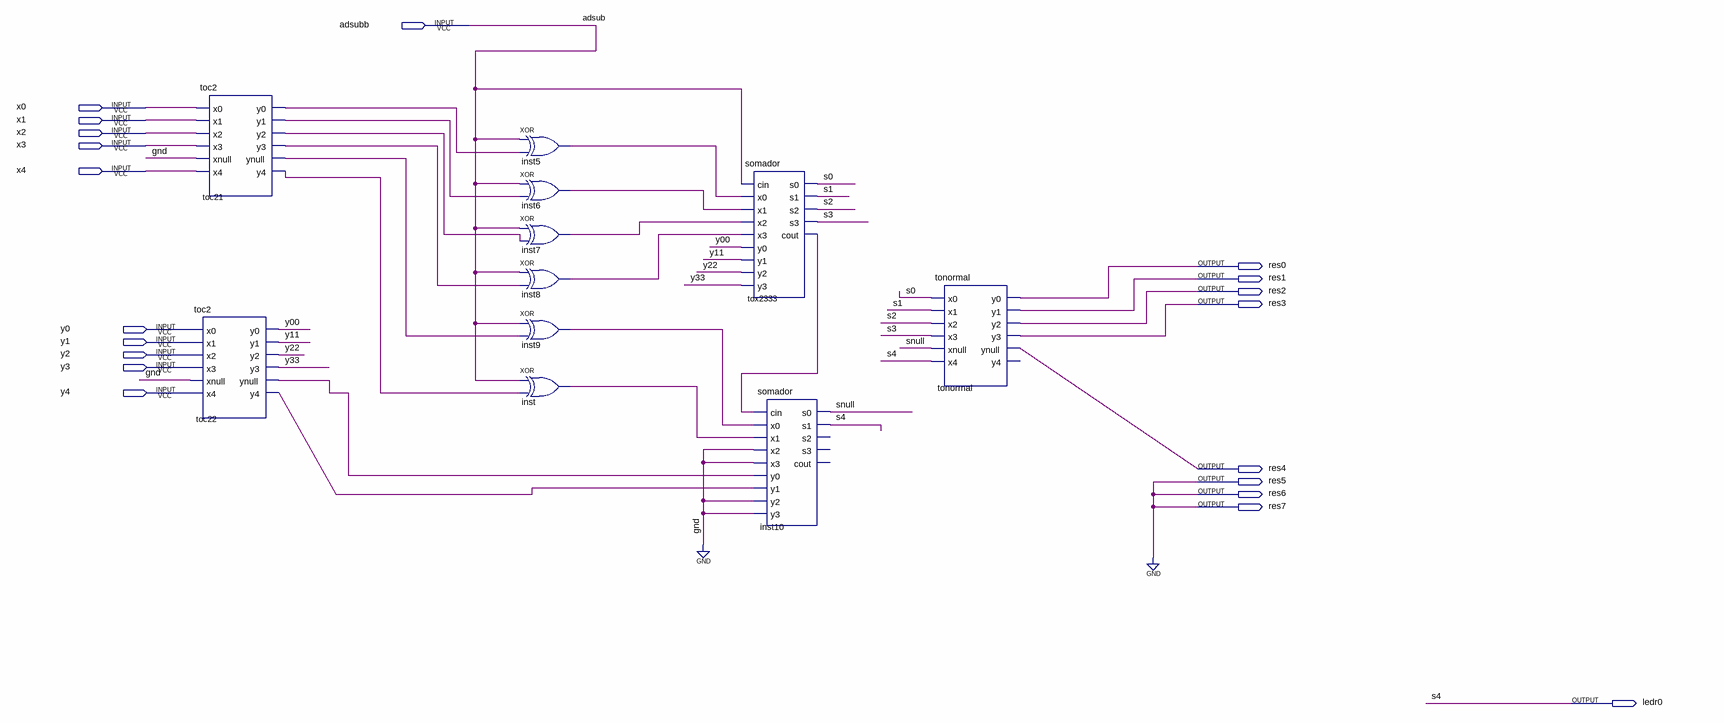
[diagram p0: schematic sheet]
// Quartus schematic subsum.bdf as structural Verilog: 11 symbols, 20 pins
module subsum (
  input  adsubb,
  input  x0,
  input  x1,
  input  x2,
  input  x3,
  input  x4,
  input  y0,
  input  y1,
  input  y2,
  input  y3,
  input  y4,
  output res0,
  output res1,
  output res2,
  output res3,
  output res4,
  output res5,
  output res6,
  output res7,
  output ledr0
);

  wire inst5_out, inst6_out, inst7_out, inst8_out, inst9_out, inst_out, s0, s1, s2, s3, snull, toc21_y0,
       toc21_y1, toc21_y2, toc21_y3, toc21_y4, toc21_ynull, toc22_y4, toc22_ynull, tox2333_cout, y00, y11,
       y22, y33;

  toc2 toc21 (
    .x0(x0), .x1(x1), .x2(x2), .x3(x3), .xnull(1'b0), .x4(x4), .y0(toc21_y0), .y1(toc21_y1), .y2(toc21_y2),
    .y3(toc21_y3), .ynull(toc21_ynull), .y4(toc21_y4));
  toc2 toc22 (
    .x0(y0), .x1(y1), .x2(y2), .x3(y3), .xnull(1'b0), .x4(y4), .y0(y00), .y1(y11), .y2(y22), .y3(y33),
    .ynull(toc22_ynull), .y4(toc22_y4));
  xor inst5 (inst5_out, adsubb, toc21_y0);
  xor inst6 (inst6_out, adsubb, toc21_y1);
  xor inst7 (inst7_out, adsubb, toc21_y2);
  xor inst8 (inst8_out, adsubb, toc21_y3);
  xor inst9 (inst9_out, adsubb, toc21_ynull);
  xor inst (inst_out, adsubb, toc21_y4);
  somador tox2333 (
    .cin(adsubb), .x0(inst5_out), .x1(inst6_out), .x2(inst7_out), .x3(inst8_out), .y0(y00), .y1(y11),
    .y2(y22), .y3(y33), .s0(s0), .s1(s1), .s2(s2), .s3(s3), .cout(tox2333_cout));
  somador inst10 (
    .cin(tox2333_cout), .x0(inst9_out), .x1(inst_out), .x2(1'b0), .x3(1'b0), .y0(toc22_ynull), .y1(toc22_y4),
    .y2(1'b0), .y3(1'b0), .s0(snull), .s1(ledr0));  // open: s2, s3, cout
  tonormal tonormal (
    .x0(s0), .x1(s1), .x2(s2), .x3(s3), .xnull(snull), .x4(ledr0), .y0(res0), .y1(res1), .y2(res2),
    .y3(res3), .ynull(res4));  // open: y4

  assign res5 = 1'b0;
  assign res6 = 1'b0;
  assign res7 = 1'b0;

  // Other names for the same wires on the sheet: adsub = adsubb; s4 = ledr0
endmodule
